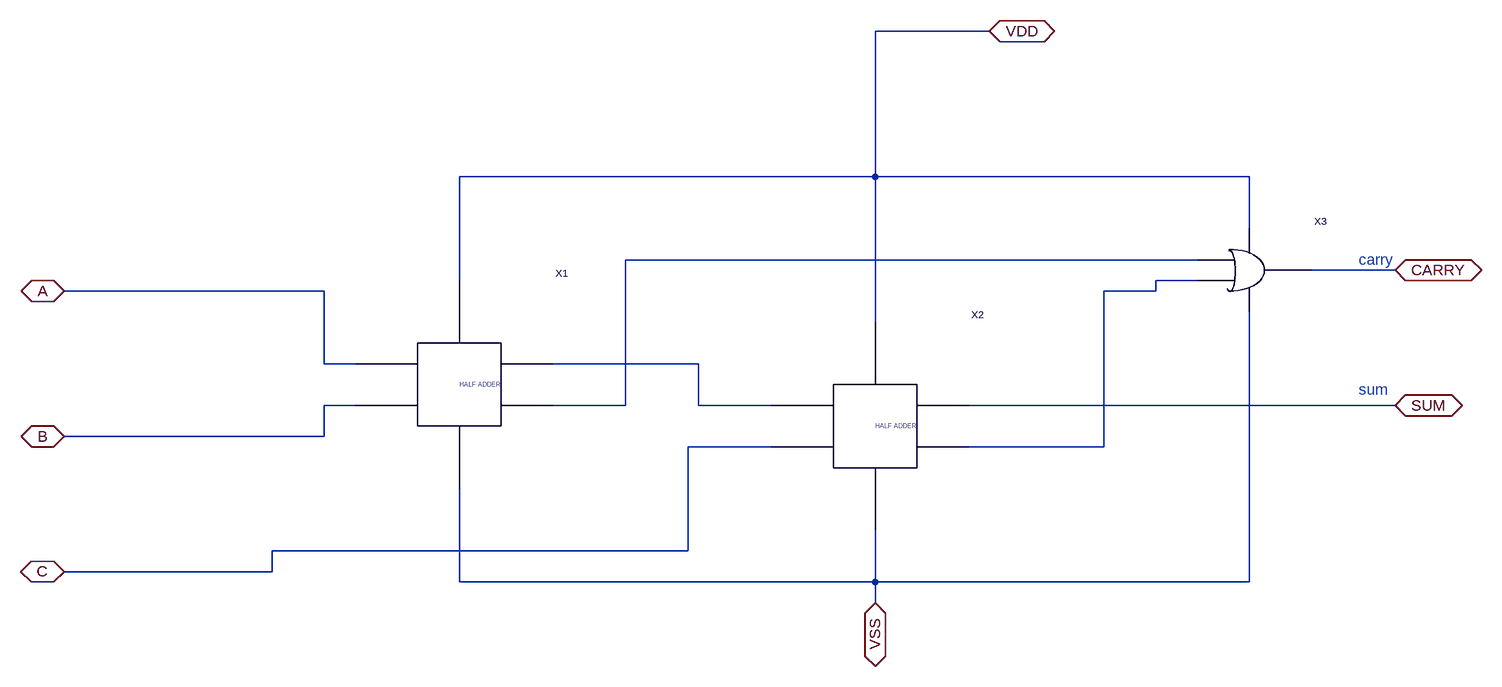
[diagram p0: schematic fulladderimply.asc]
fulladderimply.asc, the LTspice schematic file:
Version 4
SHEET 1 17532 1576
WIRE 16768 -6064 16592 -6064
WIRE 16592 -5840 16592 -6064
WIRE 16592 -5840 15952 -5840
WIRE 17168 -5840 16592 -5840
WIRE 17168 -5760 17168 -5840
WIRE 17088 -5712 16208 -5712
WIRE 17392 -5696 17264 -5696
WIRE 15952 -5680 15952 -5840
WIRE 17088 -5680 17024 -5680
WIRE 15744 -5664 15344 -5664
WIRE 17024 -5664 17024 -5680
WIRE 17024 -5664 16944 -5664
WIRE 16592 -5616 16592 -5840
WIRE 15744 -5552 15744 -5664
WIRE 15792 -5552 15744 -5552
WIRE 16320 -5552 16096 -5552
WIRE 15792 -5488 15744 -5488
WIRE 16208 -5488 16208 -5712
WIRE 16208 -5488 16096 -5488
WIRE 16320 -5488 16320 -5552
WIRE 16432 -5488 16320 -5488
WIRE 17392 -5488 16736 -5488
WIRE 15744 -5440 15744 -5488
WIRE 15744 -5440 15344 -5440
WIRE 16432 -5424 16304 -5424
WIRE 16944 -5424 16944 -5664
WIRE 16944 -5424 16736 -5424
WIRE 16304 -5264 16304 -5424
WIRE 16304 -5264 15664 -5264
WIRE 15664 -5232 15664 -5264
WIRE 15664 -5232 15344 -5232
WIRE 15952 -5216 15952 -5360
WIRE 16592 -5216 16592 -5296
WIRE 16592 -5216 15952 -5216
WIRE 17168 -5216 17168 -5632
WIRE 17168 -5216 16592 -5216
WIRE 16592 -5184 16592 -5216
FLAG 17392 -5488 SUM
IOPIN 17392 -5488 BiDir
FLAG 17392 -5696 CARRY
IOPIN 17392 -5696 BiDir
FLAG 16768 -6064 VDD
IOPIN 16768 -6064 BiDir
FLAG 16592 -5184 VSS
IOPIN 16592 -5184 BiDir
FLAG 15344 -5664 A
IOPIN 15344 -5664 BiDir
FLAG 15344 -5440 B
IOPIN 15344 -5440 BiDir
FLAG 15344 -5232 C
IOPIN 15344 -5232 BiDir
SYMBOL halfadderimply 15936 -5520 R0
SYMATTR InstName X1
SYMBOL halfadderimply 16576 -5456 R0
SYMATTR InstName X2
SYMBOL orgateimply 17088 -5680 R0
SYMATTR InstName X3
TEXT 17336 -5712 Left 2 ;carry
TEXT 17336 -5512 Left 2 ;sum

The netlist it stands for:
* fulladderimply.asc
XX1 A B VDD VSS N003 N001 halfadderimply  ; pins A B VDD VSS SUM COUT
XX2 N003 C VDD VSS SUM N002 halfadderimply  ; pins A B VDD VSS SUM COUT
XX3 VDD N001 N002 VSS CARRY orgateimply  ; pins VDD A B VSS OUT
* carry
* sum
.backanno
.end